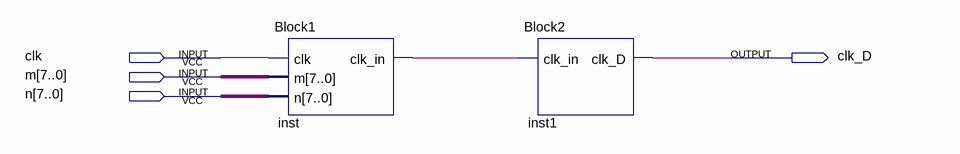
[diagram p0: schematic sheet]
// Quartus schematic Block1_2.bdf as structural Verilog: 2 symbols, 4 pins
module Block1_2 (
  input  clk,
  input  [7:0] m,
  input  [7:0] n,
  output clk_D
);

  wire inst_clk_in;

  Block1 inst (.clk(clk), .m(m), .n(n), .clk_in(inst_clk_in));
  Block2 inst1 (.clk_in(inst_clk_in), .clk_D(clk_D));
endmodule
